# Altium project sinking-clock_LED-PCB.PrjPcb
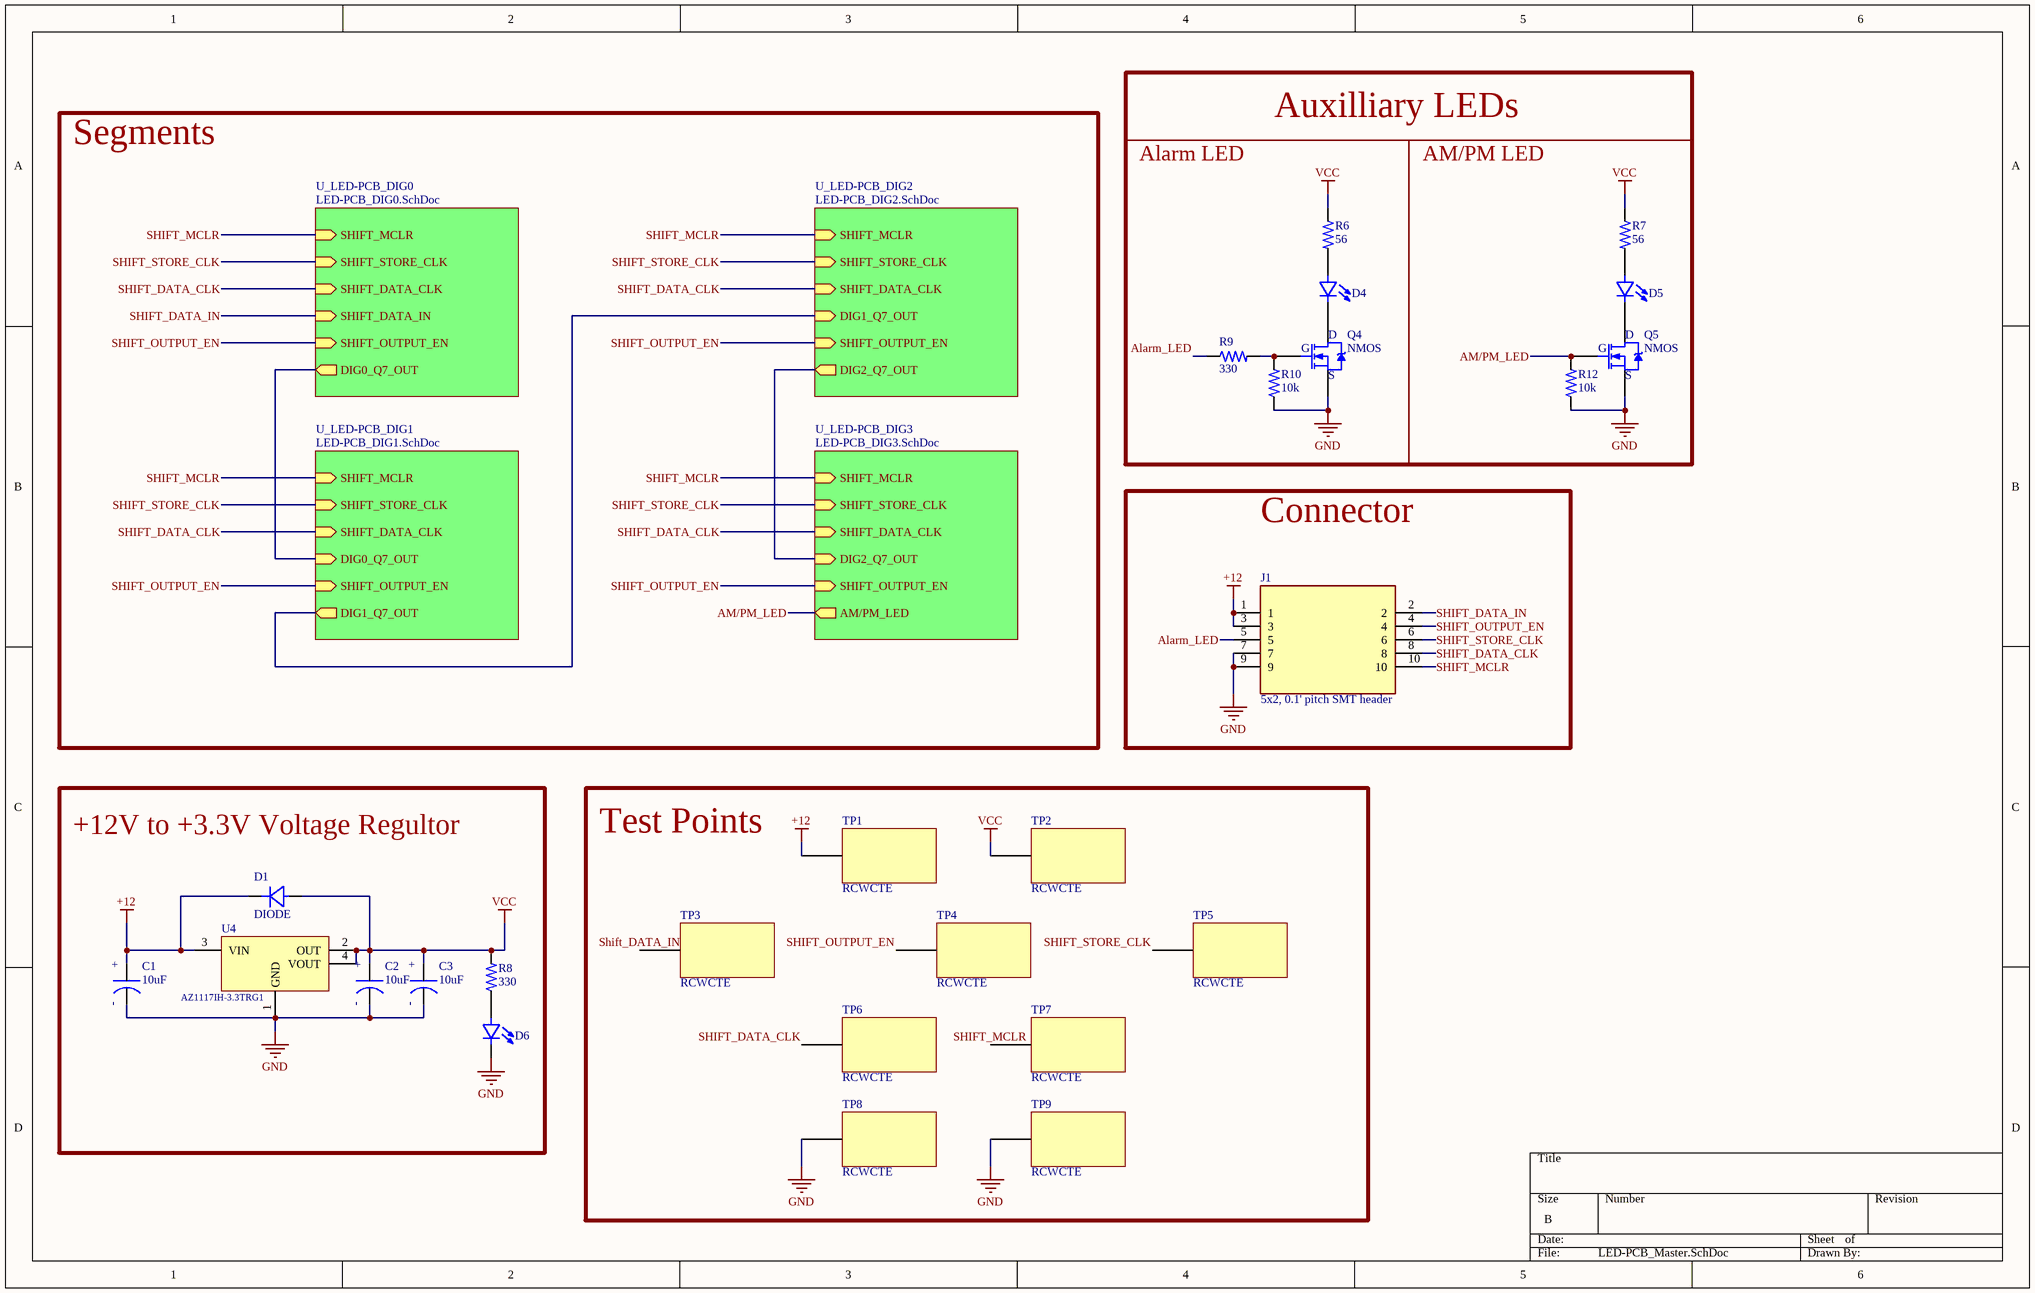
[diagram p0: LED-PCB_Master.SchDoc]
2 sheets, 61 parts. Net scope: hierarchical (ports join the sheet entries above them; power ports are global).
Board file: sinking-clock_LED-PCB.PcbDoc
Sheets:
  LED-PCB_Master.SchDoc
    U_LED-PCB_DIG2 = LED-PCB_DIG2.SchDoc

## Sheet LED-PCB_Master.SchDoc
size B; SheetNumber: 1; SheetTotal: 5

### Parts
C1  value 10uF  [CAP_CAN_POLY]  (hidden comment: CAP)
C2  value 10uF  [CAP_CAN_POLY]  (hidden comment: CAP)
C3  value 10uF  [CAP_CAN_POLY]  (hidden comment: CAP)
D1  DIODE  [DO-214AC]
D4  LED - single  [LED - 1204 RA]  (value not drawn)
D5  LED - single  [LED - 1204 RA]  (value not drawn)
D6  LED - single  [LED - 0603]  (value not drawn)
J1  5x2, 0.1' pitch SMT header  [5x2, 0.1' pitch SMT header]
Q4  NMOS  [SOT-23]
Q5  NMOS  [SOT-23]
R6  value 56  [0402 RES]  (hidden comment: RES)
R7  value 56  [0402 RES]  (hidden comment: RES)
R8  value 330  [0402 RES]  (hidden comment: RES)
R9  value 330  [0402R]  (hidden comment: RES)
R10  value 10k  [0402R]  (hidden comment: RES)
R12  value 10k  [0402R]  (hidden comment: RES)
TP1  RCWCTE  [RCWCTE]
TP2  RCWCTE  [RCWCTE]
TP3  RCWCTE  [RCWCTE]
TP4  RCWCTE  [RCWCTE]
TP5  RCWCTE  [RCWCTE]
TP6  RCWCTE  [RCWCTE]
TP7  RCWCTE  [RCWCTE]
TP8  RCWCTE  [RCWCTE]
TP9  RCWCTE  [RCWCTE]
U4  AZ1117IH-3.3TRG1  [SOT-223-3]

### Blocks framed on the sheet
Auxilliary LEDs: D4 Q4 R6 R9 R10
AM/PM LED: D5 Q5 R7 R12
Connector: J1
+12V to +3.3V Voltage Regultor: C1-C3 D1 D6 R8 U4
Test Points: TP1-TP9

### Sub-sheets
U_LED-PCB_DIG0 = LED-PCB_DIG0.SchDoc (file not in this document): SHIFT_MCLR (in), SHIFT_STORE_CLK (in), SHIFT_DATA_CLK (in), SHIFT_DATA_IN (in), SHIFT_OUTPUT_EN (in), DIG0_Q7_OUT (out)
U_LED-PCB_DIG1 = LED-PCB_DIG1.SchDoc (file not in this document): SHIFT_MCLR (in), SHIFT_STORE_CLK (in), SHIFT_DATA_CLK (in), DIG0_Q7_OUT (in), SHIFT_OUTPUT_EN (in), DIG1_Q7_OUT (out)
U_LED-PCB_DIG2 = LED-PCB_DIG2.SchDoc: SHIFT_MCLR (in), SHIFT_STORE_CLK (in), SHIFT_DATA_CLK (in), DIG1_Q7_OUT (in), SHIFT_OUTPUT_EN (in), DIG2_Q7_OUT (out)
U_LED-PCB_DIG3 = LED-PCB_DIG3.SchDoc (file not in this document): SHIFT_MCLR (in), SHIFT_STORE_CLK (in), SHIFT_DATA_CLK (in), DIG2_Q7_OUT (in), SHIFT_OUTPUT_EN (in), AM/PM_LED (out)

### Nets
+12: C1.1 D1.K J1.1 J1.3 TP1.1 U4.3(VIN)
GND: C1.2 C2.2 C3.2 D6.2(C) J1.7 J1.9 Q4.2(S) Q5.2(S) R10.1 R12.1 TP8.1 TP9.1 U4.1(GND)
VCC: C2.1 C3.1 D1.A R6.1 R7.1 R8.2 TP2.1 U4.2(OUT) U4.4(VOUT)
Alarm_LED: J1.5 R9.1
AM/PM_LED: Q5.1(G) R12.2 ; sheet U_LED-PCB_DIG3/AM/PM_LED
SHIFT_DATA_CLK: J1.8 TP6.1 ; sheet U_LED-PCB_DIG0/SHIFT_DATA_CLK, sheet U_LED-PCB_DIG1/SHIFT_DATA_CLK, sheet U_LED-PCB_DIG2/SHIFT_DATA_CLK, sheet U_LED-PCB_DIG3/SHIFT_DATA_CLK
SHIFT_DATA_IN: J1.2 TP3.1 ; sheet U_LED-PCB_DIG0/SHIFT_DATA_IN
SHIFT_MCLR: J1.10 TP7.1 ; sheet U_LED-PCB_DIG0/SHIFT_MCLR, sheet U_LED-PCB_DIG1/SHIFT_MCLR, sheet U_LED-PCB_DIG2/SHIFT_MCLR, sheet U_LED-PCB_DIG3/SHIFT_MCLR
SHIFT_OUTPUT_EN: J1.4 TP4.1 ; sheet U_LED-PCB_DIG0/SHIFT_OUTPUT_EN, sheet U_LED-PCB_DIG1/SHIFT_OUTPUT_EN, sheet U_LED-PCB_DIG2/SHIFT_OUTPUT_EN, sheet U_LED-PCB_DIG3/SHIFT_OUTPUT_EN
SHIFT_STORE_CLK: J1.6 TP5.1 ; sheet U_LED-PCB_DIG0/SHIFT_STORE_CLK, sheet U_LED-PCB_DIG1/SHIFT_STORE_CLK, sheet U_LED-PCB_DIG2/SHIFT_STORE_CLK, sheet U_LED-PCB_DIG3/SHIFT_STORE_CLK
NetD4_1: D4.1(A) R6.2
NetD4_2: D4.2(C) Q4.3(D)
NetD5_1: D5.1(A) R7.2
NetD5_2: D5.2(C) Q5.3(D)
NetD6_1: D6.1(A) R8.1
NetQ4_1: Q4.1(G) R9.2 R10.2
NetU2_9: sheet U_LED-PCB_DIG2/DIG2_Q7_OUT, sheet U_LED-PCB_DIG3/DIG2_Q7_OUT
NetU2_14: sheet U_LED-PCB_DIG1/DIG1_Q7_OUT, sheet U_LED-PCB_DIG2/DIG1_Q7_OUT
(unnamed): sheet U_LED-PCB_DIG0/DIG0_Q7_OUT, sheet U_LED-PCB_DIG1/DIG0_Q7_OUT

### Notes on the sheet
- Segments
- Alarm LED
- (in symbol CAP - POLARIZED) +; -

### Library data of the parts
C1-C3 = CAP - POLARIZED: Capacitor; MFR: Würth Elektronik; MFR PN: 865080642006; Type: SMD; Vendor: *; Vendor PN: *; Vendor Link: *; ClassName: DirectConnect
D1 = DIODE: DIODE GEN PURP; MFR: Micro Commercial Co; MFR PN: GS1M-LTP; Type: SMD; Value: *; ClassName: DirectConnect
D4 D5 = LED - single: LED; MFR: Würth Elektronik; MFR PN: 155124RS73200; Color: Red; Type: SMD; Notes: Right-Angle Sideways Mount; Vendor: *; Vendor PN: *; Vendor Link: *
D6 = LED - single: MFR PN: 5988070107F; MFR: Dialight; Color: Green; ClassName: DirectConnect
J1 = 5x2, 0.1' pitch SMT header: CONN HEADER SMD 10POS 2.54MM; MFR PN: 3020-10-0300-00; MFR: CNC Tech; ClassName: DirectConnect
Q4 Q5 = NMOS: N-Channel MOSFET; MFR PN: DMN63D8L-7; MFR: Diodes Incorporated
R6 R7 = RES: Resistor; MFR PN: RC0402FR-0756RL; MFR: YAGEO
R8 R9 = RES: Resistor; MFR PN: RC0402JR-13330RL; MFR: YAGEO
  R8: ClassName: DirectConnect
  R9: Vendor: *; Vendor PN: *; Vendor Link: *
R10 R12 = RES: Resistor; MFR PN: RC0402JR-0710KL; MFR: YAGEO; Vendor: *; Vendor PN: *; Vendor Link: *
TP1-TP9 = Test Point: MFR: KOA Speer Electronics, Inc.; MFR PN: RCWCTE
U4 = AZ1117IH-3.3TRG1: IC REG LINEAR 3.3V 1A SOT223; MFR: Diodes Incorporated; MFR PN: AZ1117IH-3.3TRG1; ClassName: DirectConnect

## Sheet LED-PCB_DIG2.SchDoc
size B; SheetNumber: 4; SheetTotal: 5
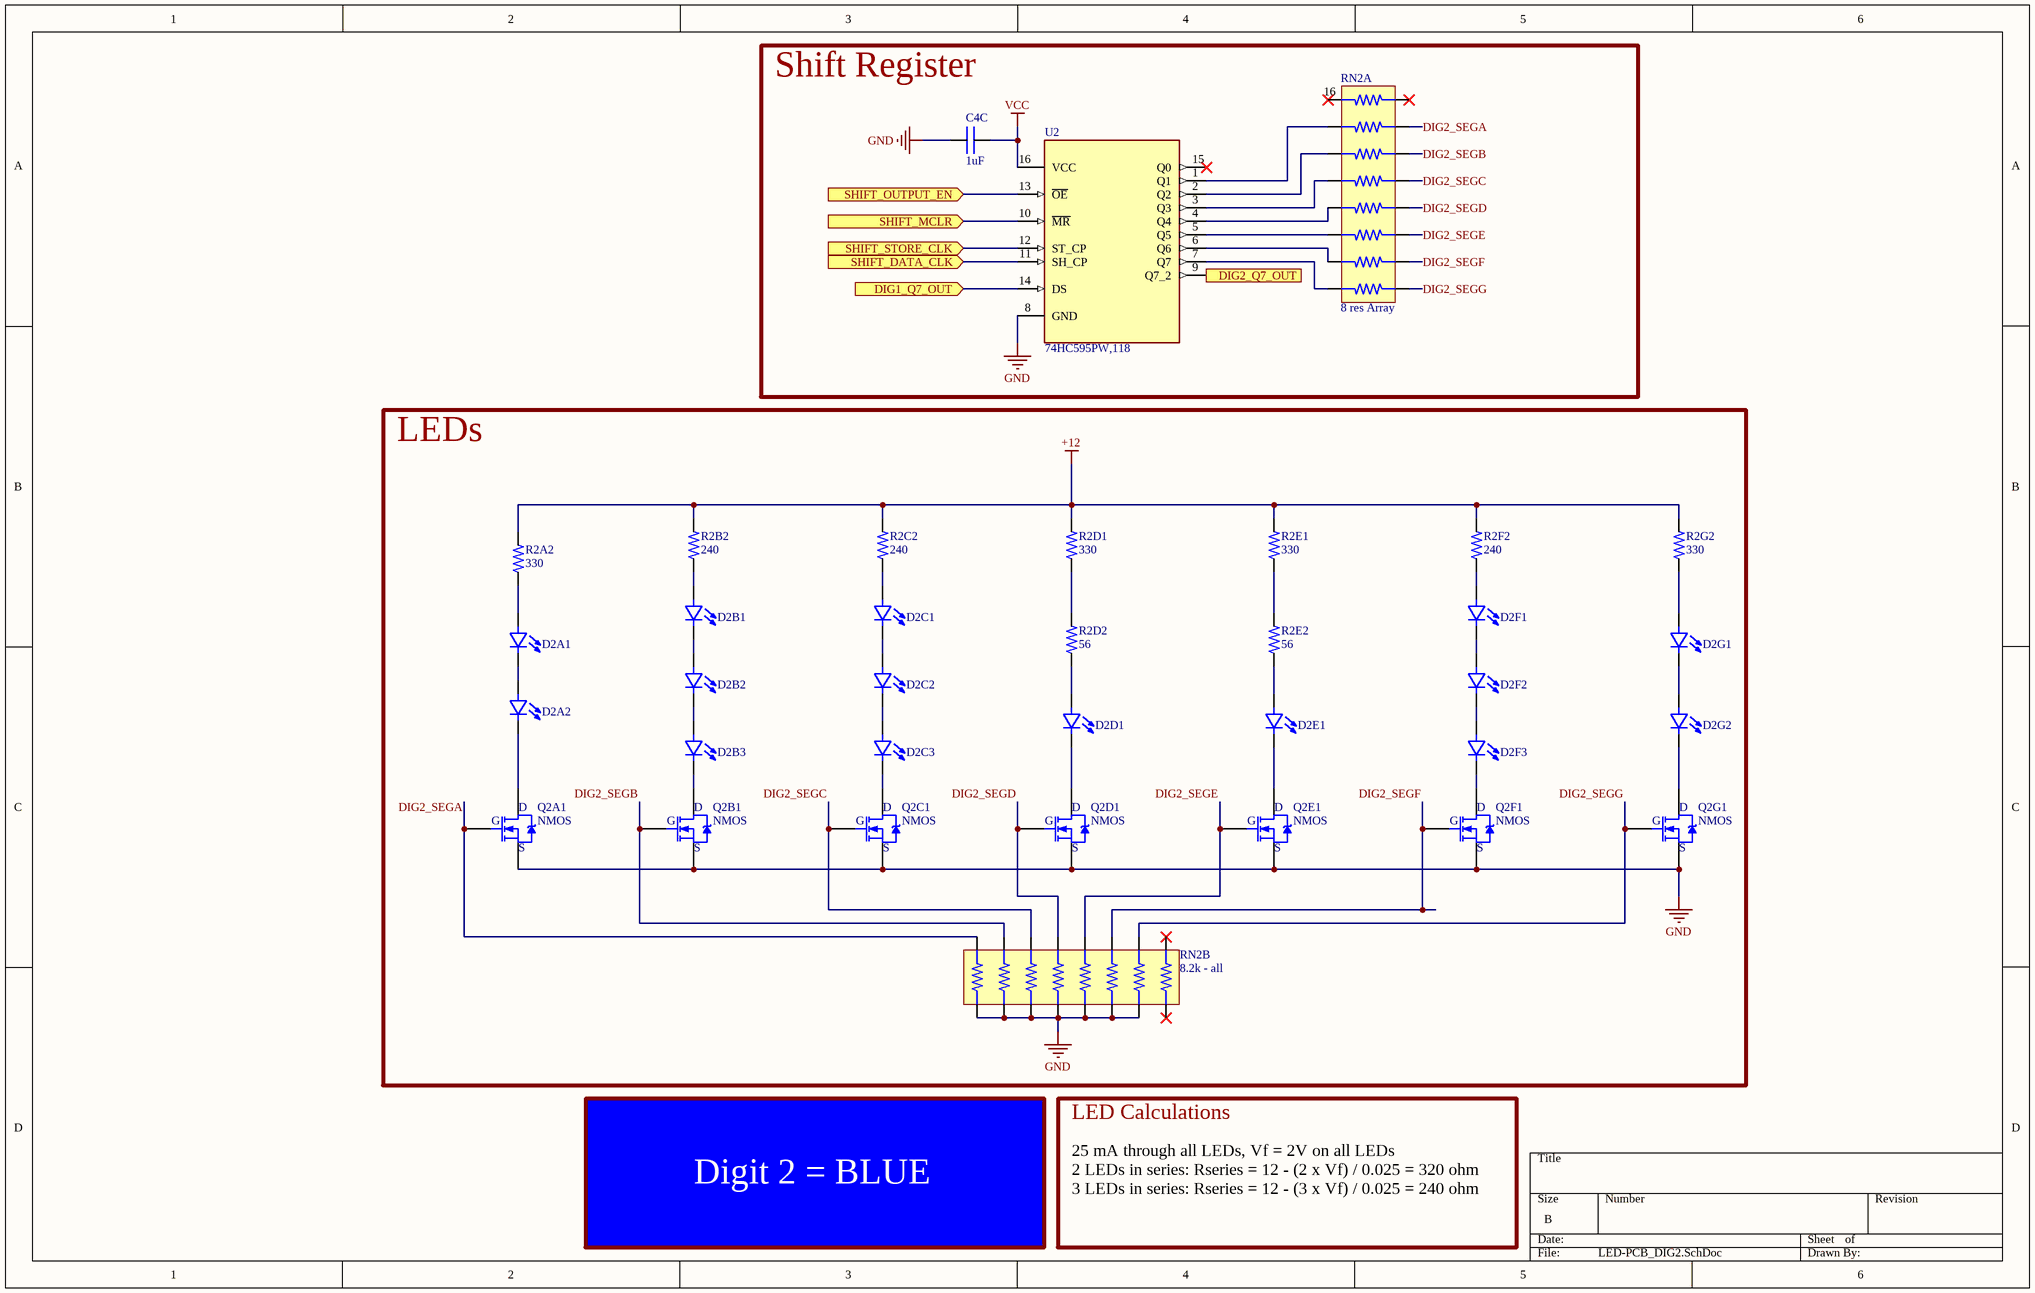
[diagram p1: LED-PCB_DIG2.SchDoc]

### Parts
C4C  value 1uF  [0402 CAP]  (hidden comment: CAP)
D2A1  LED - single  [LED - 0603]  (value not drawn)
D2A2  LED - single  [LED - 0603]  (value not drawn)
D2B1  LED - single  [LED - 0603]  (value not drawn)
D2B2  LED - single  [LED - 0603]  (value not drawn)
D2B3  LED - single  [LED - 0603]  (value not drawn)
D2C1  LED - single  [LED - 0603]  (value not drawn)
D2C2  LED - single  [LED - 0603]  (value not drawn)
D2C3  LED - single  [LED - 0603]  (value not drawn)
D2D1  LED - single  [LED - 0603]  (value not drawn)
D2E1  LED - single  [LED - 0603]  (value not drawn)
D2F1  LED - single  [LED - 0603]  (value not drawn)
D2F2  LED - single  [LED - 0603]  (value not drawn)
D2F3  LED - single  [LED - 0603]  (value not drawn)
D2G1  LED - single  [LED - 0603]  (value not drawn)
D2G2  LED - single  [LED - 0603]  (value not drawn)
Q2A1  NMOS  [SOT-23]
Q2B1  NMOS  [SOT-23]
Q2C1  NMOS  [SOT-23]
Q2D1  NMOS  [SOT-23]
Q2E1  NMOS  [SOT-23]
Q2F1  NMOS  [SOT-23]
Q2G1  NMOS  [SOT-23]
R2A2  value 330  [0402 RES]  (hidden comment: RES)
R2B2  value 240  [0402 RES]  (hidden comment: RES)
R2C2  value 240  [0402 RES]  (hidden comment: RES)
R2D1  value 330  [0402 RES]  (hidden comment: RES)
R2D2  value 56  [0402 RES]  (hidden comment: RES)
R2E1  value 330  [0402 RES]  (hidden comment: RES)
R2E2  value 56  [0402 RES]  (hidden comment: RES)
R2F2  value 240  [0402 RES]  (hidden comment: RES)
R2G2  value 330  [0402 RES]  (hidden comment: RES)
RN2A  8 res Array  [EXB2HV331JV]
RN2B  8.2k - all  [MNR18ERAPJ822]
U2  74HC595PW,118  [16-TSSOP]

### Blocks framed on the sheet
Shift Register: C4C RN2A U2
LEDs: D2A1 D2A2 D2B1-D2B3 D2C1-D2C3 D2D1 D2E1 D2F1-D2F3 D2G1 D2G2 Q2A1 Q2B1 Q2C1 Q2D1 Q2E1 Q2F1 Q2G1 R2A2 R2B2 R2C2 R2D1 R2D2 R2E1 R2E2 R2F2 R2G2 RN2B

### Ports
DIG1_Q7_OUT (in, see LED-PCB_Master[3A], LED-PCB_DIG1[4A]), DIG2_Q7_OUT (out, see LED-PCB_Master[3B], LED-PCB_DIG3[2B]), SHIFT_DATA_CLK (in, see LED-PCB_Master[3A], LED-PCB_DIG0[3A], LED-PCB_DIG1[3A], LED-PCB_DIG3[2B]), SHIFT_MCLR (in, see LED-PCB_Master[3A], LED-PCB_DIG0[3A], LED-PCB_DIG1[3A], LED-PCB_DIG3[2B]), SHIFT_OUTPUT_EN (in, see LED-PCB_Master[3B], LED-PCB_DIG0[3A], LED-PCB_DIG1[3A], LED-PCB_DIG3[2B]), SHIFT_STORE_CLK (in, see LED-PCB_Master[3A], LED-PCB_DIG0[3A], LED-PCB_DIG1[3A], LED-PCB_DIG3[2B])

### Nets
+12: R2A2.2 R2B2.2 R2C2.2 R2D1.2 R2E1.2 R2F2.2 R2G2.2
GND: C4C.1 Q2A1.2(S) Q2B1.2(S) Q2C1.2(S) Q2D1.2(S) Q2E1.2(S) Q2F1.2(S) Q2G1.2(S) RN2B.1 RN2B.2 RN2B.3 RN2B.4 RN2B.5 RN2B.6 RN2B.7 U2.8(GND)
VCC: C4C.2 U2.16(VCC)
DIG2_SEGA: Q2A1.1(G) RN2A.2 RN2B.16
DIG2_SEGB: Q2B1.1(G) RN2A.3 RN2B.15
DIG2_SEGC: Q2C1.1(G) RN2A.4 RN2B.14
DIG2_SEGD: Q2D1.1(G) RN2A.5 RN2B.13
DIG2_SEGE: Q2E1.1(G) RN2A.6 RN2B.12
DIG2_SEGF: Q2F1.1(G) RN2A.7 RN2B.11
DIG2_SEGG: Q2G1.1(G) RN2A.8 RN2B.10
SHIFT_DATA_CLK: U2.11(SH_CP) ; port SHIFT_DATA_CLK
SHIFT_MCLR: U2.10(~{MR}) ; port SHIFT_MCLR
SHIFT_OUTPUT_EN: U2.13(~{OE}) ; port SHIFT_OUTPUT_EN
SHIFT_STORE_CLK: U2.12(ST_CP) ; port SHIFT_STORE_CLK
NetD2A1_1: D2A1.1(A) R2A2.1
NetD2A1_2: D2A1.2(C) D2A2.1(A)
NetD2A2_2: D2A2.2(C) Q2A1.3(D)
NetD2B1_1: D2B1.1(A) R2B2.1
NetD2B1_2: D2B1.2(C) D2B2.1(A)
NetD2B2_2: D2B2.2(C) D2B3.1(A)
NetD2B3_2: D2B3.2(C) Q2B1.3(D)
NetD2C1_1: D2C1.1(A) R2C2.1
NetD2C1_2: D2C1.2(C) D2C2.1(A)
NetD2C2_2: D2C2.2(C) D2C3.1(A)
NetD2C3_2: D2C3.2(C) Q2C1.3(D)
NetD2D1_1: D2D1.1(A) R2D2.1
NetD2D1_2: D2D1.2(C) Q2D1.3(D)
NetD2E1_1: D2E1.1(A) R2E2.1
NetD2E1_2: D2E1.2(C) Q2E1.3(D)
NetD2F1_1: D2F1.1(A) R2F2.1
NetD2F1_2: D2F1.2(C) D2F2.1(A)
NetD2F2_2: D2F2.2(C) D2F3.1(A)
NetD2F3_2: D2F3.2(C) Q2F1.3(D)
NetD2G1_1: D2G1.1(A) R2G2.1
NetD2G1_2: D2G1.2(C) D2G2.1(A)
NetD2G2_2: D2G2.2(C) Q2G1.3(D)
NetR2D1_1: R2D1.1 R2D2.2
NetR2E1_1: R2E1.1 R2E2.2
NetRN2A_9: RN2A.9 U2.7(Q7)
NetRN2A_10: RN2A.10 U2.6(Q6)
NetRN2A_11: RN2A.11 U2.5(Q5)
NetRN2A_12: RN2A.12 U2.4(Q4)
NetRN2A_13: RN2A.13 U2.3(Q3)
NetRN2A_14: RN2A.14 U2.2(Q2)
NetRN2A_15: RN2A.15 U2.1(Q1)
NetU2_9: U2.9(Q7_2) ; port DIG2_Q7_OUT
NetU2_14: U2.14(DS) ; port DIG1_Q7_OUT

Not connected (* = marked no-connect by the designer): RN2A 1* 16*; RN2B 8* 9*; U2 15(Q0)*

### Notes on the sheet
- LED Calculations
- Digit 2 = BLUE
- 25 mA through all LEDs, Vf = 2V on all LEDs
  2 LEDs in series: Rseries = 12 - (2 x Vf) / 0.025 = 320 ohm
  3 LEDs in series: Rseries = 12 - (3 x Vf) / 0.025 = 240 ohm

### Library data of the parts
C4C = CAP: Capaicitor; MFR PN: CL05A105KP5NNNC; MFR: Samsung Microelectronics
D2A1 D2A2 D2B1-D2B3 D2C1-D2C3 D2D1 D2E1 D2F1-D2F3 D2G1 D2G2 = LED - single: MFR PN: 150060RS75000; MFR: Wurth Elektronik; Color: Red
Q2A1 Q2B1 Q2C1 Q2D1 Q2E1 Q2F1 Q2G1 = NMOS: as Q4 on sheet LED-PCB_Master
R2A2 R2D1 R2E1 R2G2 = RES: as R8 on sheet LED-PCB_Master
R2B2 R2C2 R2F2 = RES: Resistor; MFR PN: RC0402FR-07240RL; MFR: YAGEO
R2D2 R2E2 = RES: as R6 on sheet LED-PCB_Master
RN2A = 8 res Array: MFR PN: EXB-2HV331JV; MFR: Panasonic Microelectronics; Value: 330; Vendor: *; Vendor PN: *; ComponentLink1Description: New link; ComponentLink1URL: *; ComponentLink2Description: New link 1; ComponentLink2URL: *; Vendor Link: *
RN2B = MNR18ERAPJ822: 8.2k Ohm ±5% 62.5mW Power Per Element Isolated 8 Resistor Network/Array ±250ppm/°C 1606, Convex, Long Side Terminals; MFR: Rohm Semiconductor; MFR PN: MNR18ERAPJ822
U2 = 74HC595PW,118: Shift Shift Register 1 Element 8 Bit 16-TSSOP; MFR PN: 74HC595PW,118; Nexperia USA: *

## Nets that join several sheets
+12: LED-PCB_Master (6 pins), LED-PCB_DIG2 (7 pins)
GND: LED-PCB_Master (13 pins), LED-PCB_DIG2 (16 pins)
VCC: LED-PCB_Master (9 pins), LED-PCB_DIG2 (C4C.2 U2.16)
SHIFT_DATA_CLK: LED-PCB_Master (J1.8 TP6.1), LED-PCB_DIG2 (U2.11)
SHIFT_MCLR: LED-PCB_Master (J1.10 TP7.1), LED-PCB_DIG2 (U2.10)
SHIFT_OUTPUT_EN: LED-PCB_Master (J1.4 TP4.1), LED-PCB_DIG2 (U2.13)
SHIFT_STORE_CLK: LED-PCB_Master (J1.6 TP5.1), LED-PCB_DIG2 (U2.12)